# Altium schematic sheet Sensors and IO.SchDoc
size A
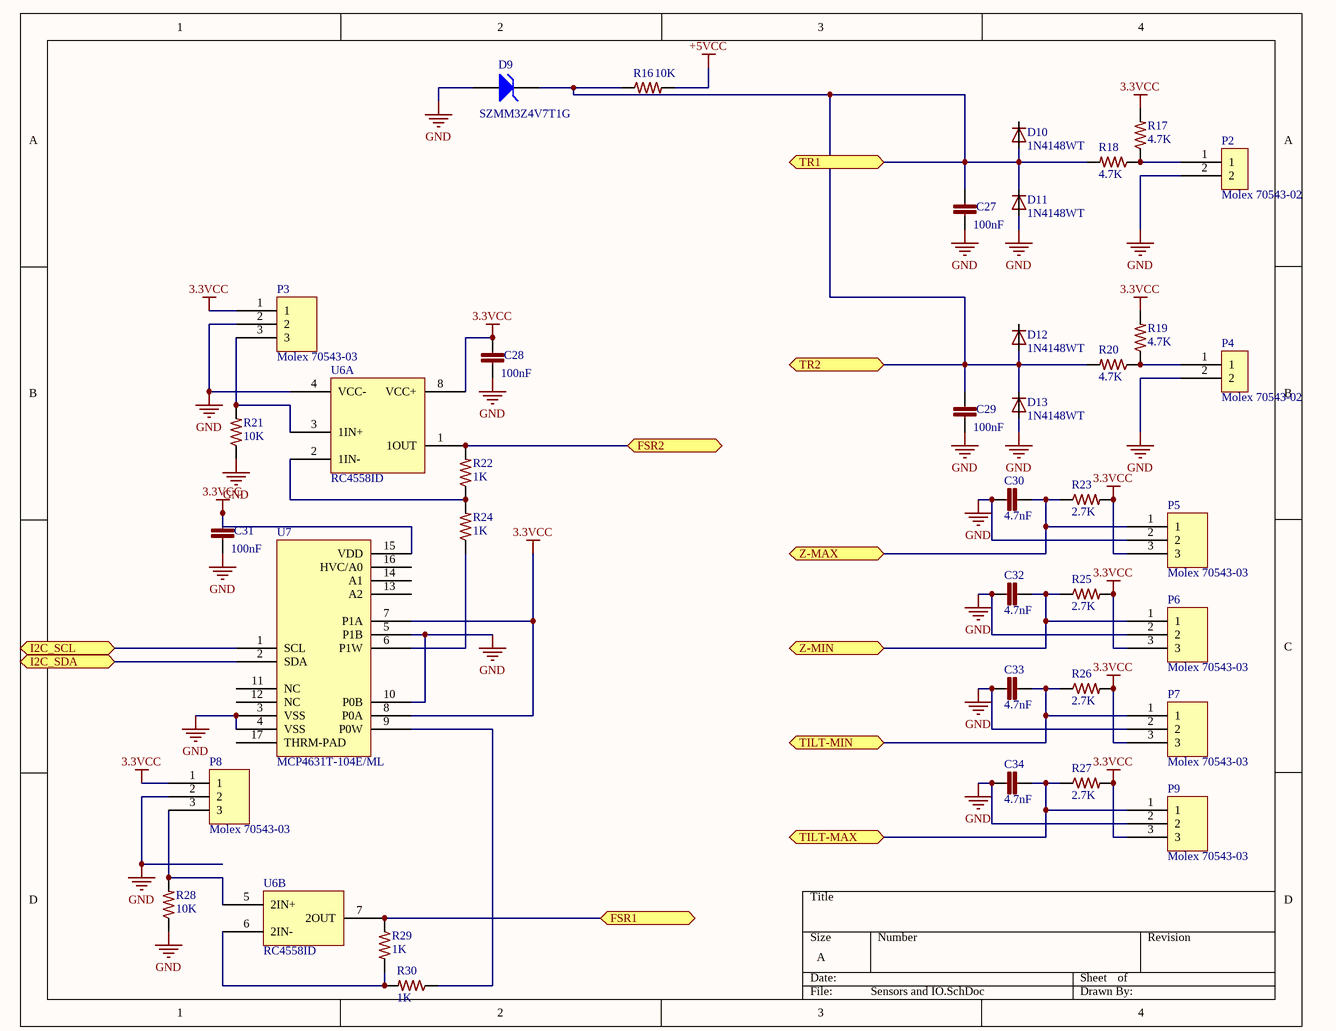
[diagram p0: Sensors and IO.SchDoc]

## Parts
C27  100nF  [C0402]
C28  100nF  [C0402]
C29  100nF  [C0402]
C30  4.7nF  [C0402]
C31  100nF  [C0402]
C32  4.7nF  [C0402]
C33  4.7nF  [C0402]
C34  4.7nF  [C0402]
D9  SZMM3Z4V7T1G  [SZMM3Z4V7T1G]
D10  1N4148WT  [SOD523]
D11  1N4148WT  [SOD523]
D12  1N4148WT  [SOD523]
D13  1N4148WT  [SOD523]
P2  Molex 70543-02  [70543-02]
P3  Molex 70543-03  [70543-03]
P4  Molex 70543-02  [70543-02]
P5  Molex 70543-03  [70543-03]
P6  Molex 70543-03  [70543-03]
P7  Molex 70543-03  [70543-03]
P8  Molex 70543-03  [70543-03]
P9  Molex 70543-03  [70543-03]
R16  10K  [R0603]
R17  4.7K  [R0603]
R18  4.7K  [R0603]
R19  4.7K  [R0603]
R20  4.7K  [R0603]
R21  10K  [R0603]
R22  1K  [R0603]
R23  2.7K  [R0402]
R24  1K  [R0603]
R25  2.7K  [R0402]
R26  2.7K  [R0402]
R27  2.7K  [R0402]
R28  10K  [R0603]
R29  1K  [R0603]
R30  1K  [R0603]
U6  RC4558ID  [TSOP65P490X110-8N]  (parts A,B of 2)
U7  MCP4631T-104E/ML  [MCP4631T-104E/ML]

## Ports
FSR1, FSR2, I2C_SCL, I2C_SDA, TILT-MAX, TILT-MIN, TR1, TR2, Z-MAX, Z-MIN

## Nets
3.3VCC: C28.1 C31.1 P3.1 P5.3 P6.3 P7.3 P8.1 P9.3 R17.2 R19.2 R23.2 R25.2 R26.2 R27.2 U6.8(VCC+) U7.7(P1A) U7.8(P0A) U7.15(VDD)
+5VCC: R16.2
GND: C27.2 C28.2 C29.2 C30.1 C31.2 C32.1 C33.1 C34.1 D9.1(A) D11.A D13.A P2.2 P3.2 P4.2 P5.2 P6.2 P7.2 P8.2 P9.2 R21.1 R28.1 U6.4(VCC-) U7.3(VSS) U7.4(VSS) U7.5(P1B) U7.10(P0B)
FSR1: R29.1 U6.7(2OUT) ; port FSR1
FSR2: R22.2 U6.1(1OUT) ; port FSR2
I2C_SCL: U7.1(SCL) ; port I2C_SCL
I2C_SDA: U7.2(SDA) ; port I2C_SDA
TILT-MAX: C34.2 P9.1 R27.1 ; port TILT-MAX
TILT-MIN: C33.2 P7.1 R26.1 ; port TILT-MIN
TR1: C27.1 C29.1 D9.2(K) D10.A D11.C D12.A D13.C R16.1 R18.2 R20.2 ; port TR1, port TR2
Z-MAX: C30.2 P5.1 R23.1 ; port Z-MAX
Z-MIN: C32.2 P6.1 R25.1 ; port Z-MIN
NetP2_1: P2.1 R17.1 R18.1
NetP3_3: P3.3 R21.2 U6.3(1IN+)
NetP4_1: P4.1 R19.1 R20.1
NetP8_3: P8.3 R28.2 U6.5(2IN+)
NetR22_1: R22.1 R24.2 U6.2(1IN-)
NetR24_1: R24.1 U7.6(P1W)
NetR29_2: R29.2 R30.2 U6.6(2IN-)
NetR30_1: R30.1 U7.9(P0W)

Not connected (* = marked no-connect by the designer): D10 C; D12 C; U7 11(NC) 12(NC) 13(A2) 14(A1) 16(HVC/A0) 17(THRM-PAD)

## Library data of the parts
C27-C29 C31 = GRM155R71C104KA88D: CAP CER 0402 100nF 16V 10% X7R; LastRevisionNote: ImportComponents; Published: 23-Apr-2014; Publisher: UltiMachine; LastRevisionDate: 23-Apr-2014; ManufacturerPartNumber: GRM155R71C104KA88D; VALUE: 100nF
C30 C32-C34 = CC0402KRX7R8BB472: CAP CER 0402 4.7nF 25V 10% X7R; LastRevisionNote: ImportComponents; Published: 23-Apr-2014; Publisher: UltiMachine; LastRevisionDate: 23-Apr-2014; ManufacturerPartNumber: CC0402KRX7R8BB472; VALUE: 4.7nF
D9 = D Zener: Zener Diode; Published: 8-Jun-2000; LatestRevisionDate: 17-Jul-2002; LatestRevisionNote: Re-released for DXP Platform.; PackageReference: DIODE-0.7; Publisher: Altium Limited; PackageDescription: Diode, Thru-Hole; 2 Leads; 0.7 in Pin Spacing
D10-D13 = 1N4148WT: DIODE SOD523; LastRevisionNote: ImportComponents; Published: 23-Apr-2014; Publisher: UltiMachine; LastRevisionDate: 23-Apr-2014; Value: 1N4148WT
P3 P5-P9 = Molex Endstop
R16 R21 R28 = ERJ-3EKF1002V: RES 0603 10K 100mW 1%; LastRevisionNote: ImportComponents; Published: 23-Apr-2014; Publisher: UltiMachine; LastRevisionDate: 23-Apr-2014; ManufacturerPartNumber: ERJ-3EKF1002V; VALUE: 10K
R17-R20 = ERJ3EKF4701V: RES 0603 4.7K 100mW 1%; LastRevisionNote: ImportComponents; Published: 23-Apr-2014; Publisher: UltiMachine; LastRevisionDate: 23-Apr-2014; ManufacturerPartNumber: ERJ3EKF4701V; VALUE: 4.7K
R22 R24 R29 R30 = ERJ-3EKF1001V: RES 0603 1K 100mW 1%; LastRevisionNote: ImportComponents; Published: 23-Apr-2014; Publisher: UltiMachine; LastRevisionDate: 23-Apr-2014; ManufacturerPartNumber: ERJ-3EKF1001V; VALUE: 1K
R23 R25-R27 = ERJ-2GEJ272X: RES SMD 2.7K OHM 5% 1/10W 0402; LastRevisionNote: ImportComponents; Published: 23-Apr-2014; Publisher: Adam Vadala-Roth; LastRevisionDate: 23-Apr-2014; ManufacturerPartNumber: ERJ-2GEJ272X; Digikey #: P2.7KJCT-ND; Tolerance: 5%; Mounting type: SMD; VALUE: 2.7K
U6 = RC4558ID: MFR: Ti; MFR #: RC4558ID
U7 = MCP4631T-104E/ML: IC DGTL POT 100K 129TAPS 16-QF; MFR: Microchip; MFR #: MCP4631T-104E/ML; Published Date: May 2015; Digikey #: MCP4631T-104E/MLCT-ND; Mounting Type: SMT QFN 16; Package: QFN 16